# EAGLE design tabletmini (EAGLE 8.4.3)
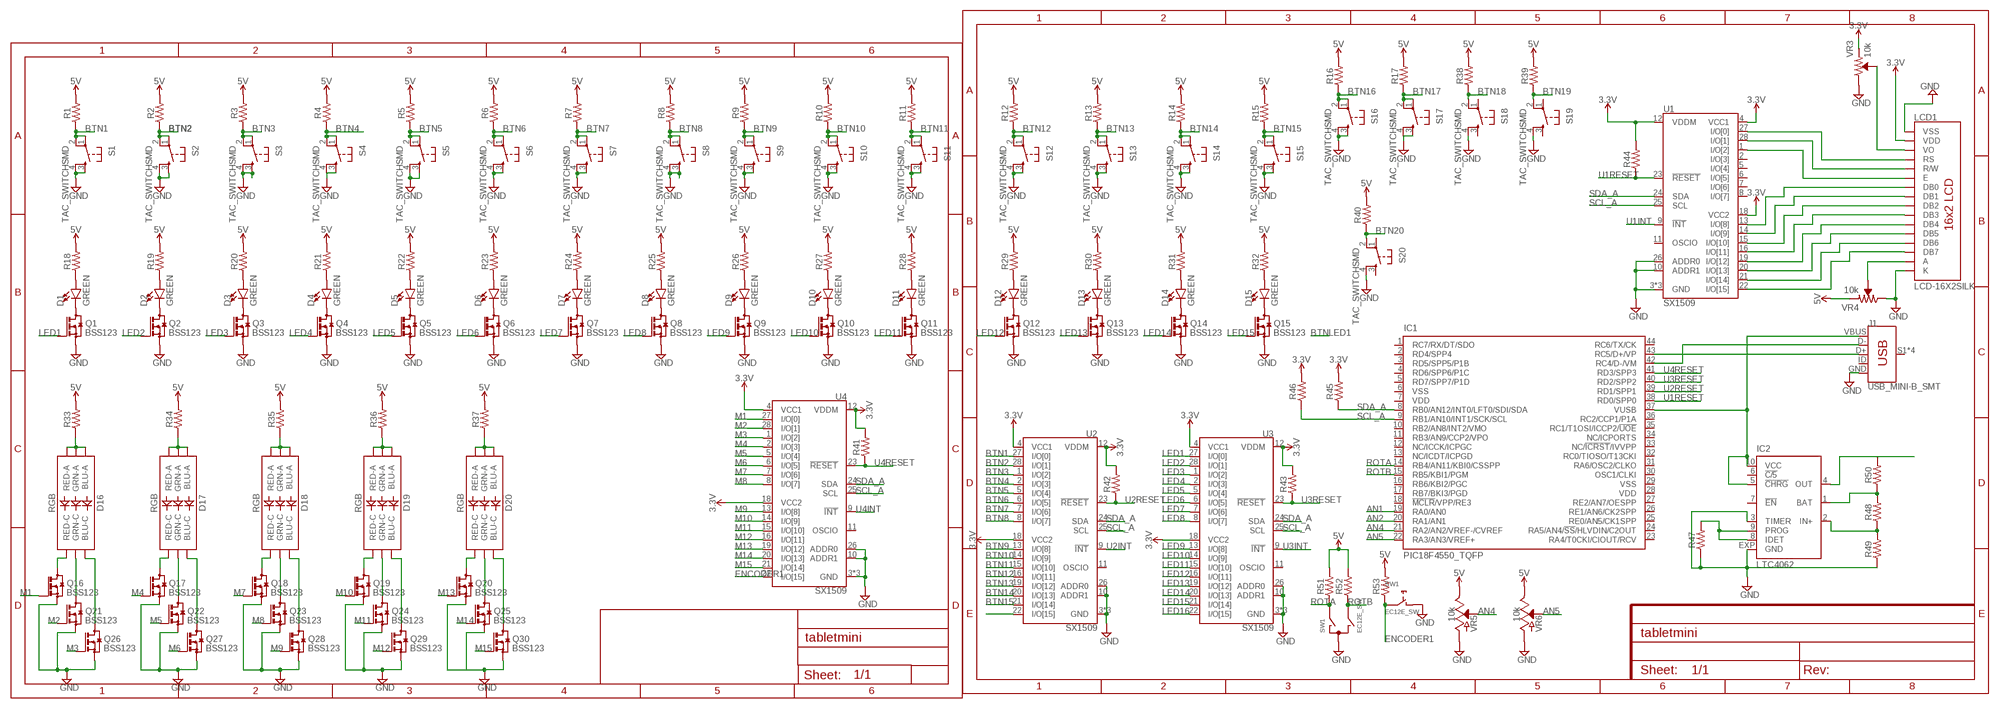
[diagram p0: schematic, sheet 1]

## Parts
D1  GREEN  LED-GREEN1206  [LED-1206]
D2  GREEN  LED-GREEN1206  [LED-1206]
D3  GREEN  LED-GREEN1206  [LED-1206]
D4  GREEN  LED-GREEN1206  [LED-1206]
D5  GREEN  LED-GREEN1206  [LED-1206]
D6  GREEN  LED-GREEN1206  [LED-1206]
D7  GREEN  LED-GREEN1206  [LED-1206]
D8  GREEN  LED-GREEN1206  [LED-1206]
D9  GREEN  LED-GREEN1206  [LED-1206]
D10  GREEN  LED-GREEN1206  [LED-1206]
D11  GREEN  LED-GREEN1206  [LED-1206]
D12  GREEN  LED-GREEN1206  [LED-1206]
D13  GREEN  LED-GREEN1206  [LED-1206]
D14  GREEN  LED-GREEN1206  [LED-1206]
D15  GREEN  LED-GREEN1206  [LED-1206]
D16  RGB  LED-RGBPLCC-6  [PLCC-6-LED]
D17  RGB  LED-RGBPLCC-6  [PLCC-6-LED]
D18  RGB  LED-RGBPLCC-6  [PLCC-6-LED]
D19  RGB  LED-RGBPLCC-6  [PLCC-6-LED]
D20  RGB  LED-RGBPLCC-6  [PLCC-6-LED]
IC1  PIC18F4550_TQFP  [TQFP44]
IC2  LTC4062  [DFN10-3X3]
J1  USB_MINI-B_SMT  [USB-MINIB]
LCD1  LCD-16X2SILK  [LCD-16X2]
Q1  BSS123  [SOT23]
Q2  BSS123  [SOT23]
Q3  BSS123  [SOT23]
Q4  BSS123  [SOT23]
Q5  BSS123  [SOT23]
Q6  BSS123  [SOT23]
Q7  BSS123  [SOT23]
Q8  BSS123  [SOT23]
Q9  BSS123  [SOT23]
Q10  BSS123  [SOT23]
Q11  BSS123  [SOT23]
Q12  BSS123  [SOT23]
Q13  BSS123  [SOT23]
Q14  BSS123  [SOT23]
Q15  BSS123  [SOT23]
Q16  BSS123  [SOT23]
Q17  BSS123  [SOT23]
Q18  BSS123  [SOT23]
Q19  BSS123  [SOT23]
Q20  BSS123  [SOT23]
Q21  BSS123  [SOT23]
Q22  BSS123  [SOT23]
Q23  BSS123  [SOT23]
Q24  BSS123  [SOT23]
Q25  BSS123  [SOT23]
Q26  BSS123  [SOT23]
Q27  BSS123  [SOT23]
Q28  BSS123  [SOT23]
Q29  BSS123  [SOT23]
Q30  BSS123  [SOT23]
R1  RESISTOR1206  [1206]
R2  RESISTOR1206  [1206]
R3  RESISTOR1206  [1206]
R4  RESISTOR1206  [1206]
R5  RESISTOR1206  [1206]
R6  RESISTOR1206  [1206]
R7  RESISTOR1206  [1206]
R8  RESISTOR1206  [1206]
R9  RESISTOR1206  [1206]
R10  RESISTOR1206  [1206]
R11  RESISTOR1206  [1206]
R12  RESISTOR1206  [1206]
R13  RESISTOR1206  [1206]
R14  RESISTOR1206  [1206]
R15  RESISTOR1206  [1206]
R16  RESISTOR1206  [1206]
R17  RESISTOR1206  [1206]
R18  RESISTOR1206  [1206]
R19  RESISTOR1206  [1206]
R20  RESISTOR1206  [1206]
R21  RESISTOR1206  [1206]
R22  RESISTOR1206  [1206]
R23  RESISTOR1206  [1206]
R24  RESISTOR1206  [1206]
R25  RESISTOR1206  [1206]
R26  RESISTOR1206  [1206]
R27  RESISTOR1206  [1206]
R28  RESISTOR1206  [1206]
R29  RESISTOR1206  [1206]
R30  RESISTOR1206  [1206]
R31  RESISTOR1206  [1206]
R32  RESISTOR1206  [1206]
R33  RESISTOR1206  [1206]
R34  RESISTOR1206  [1206]
R35  RESISTOR1206  [1206]
R36  RESISTOR1206  [1206]
R37  RESISTOR1206  [1206]
R38  RESISTOR1206  [1206]
R39  RESISTOR1206  [1206]
R40  RESISTOR1206  [1206]
R41  RESISTOR1206  [1206]
R42  RESISTOR1206  [1206]
R43  RESISTOR1206  [1206]
R44  RESISTOR1206  [1206]
R45  RESISTOR1206  [1206]
R46  RESISTOR1206  [1206]
R47  RESISTOR1206  [1206]
R48  RESISTOR1206  [1206]
R49  RESISTOR1206  [1206]
R50  RESISTOR1206  [1206]
R51  RESISTOR1206  [1206]
R52  RESISTOR1206  [1206]
R53  RESISTOR1206  [1206]
S1  TAC_SWITCHSMD  [TACTILE-SWITCH-SMD]
S2  TAC_SWITCHSMD  [TACTILE-SWITCH-SMD]
S3  TAC_SWITCHSMD  [TACTILE-SWITCH-SMD]
S4  TAC_SWITCHSMD  [TACTILE-SWITCH-SMD]
S5  TAC_SWITCHSMD  [TACTILE-SWITCH-SMD]
S6  TAC_SWITCHSMD  [TACTILE-SWITCH-SMD]
S7  TAC_SWITCHSMD  [TACTILE-SWITCH-SMD]
S8  TAC_SWITCHSMD  [TACTILE-SWITCH-SMD]
S9  TAC_SWITCHSMD  [TACTILE-SWITCH-SMD]
S10  TAC_SWITCHSMD  [TACTILE-SWITCH-SMD]
S11  TAC_SWITCHSMD  [TACTILE-SWITCH-SMD]
S12  TAC_SWITCHSMD  [TACTILE-SWITCH-SMD]
S13  TAC_SWITCHSMD  [TACTILE-SWITCH-SMD]
S14  TAC_SWITCHSMD  [TACTILE-SWITCH-SMD]
S15  TAC_SWITCHSMD  [TACTILE-SWITCH-SMD]
S16  TAC_SWITCHSMD  [TACTILE-SWITCH-SMD]
S17  TAC_SWITCHSMD  [TACTILE-SWITCH-SMD]
S18  TAC_SWITCHSMD  [TACTILE-SWITCH-SMD]
S19  TAC_SWITCHSMD  [TACTILE-SWITCH-SMD]
S20  TAC_SWITCHSMD  [TACTILE-SWITCH-SMD]
SW1  EC12E_SW  [ALPS_EC12E_SW]
U1  SX1509  [QFN-28]
U2  SX1509  [QFN-28]
U3  SX1509  [QFN-28]
U4  SX1509  [QFN-28]
VR3  10k  TRIMPOT-SMD-3MM-CLOSED-1/8W-20%  [TRIMPOT-SMD-3MM-CLOSED]
VR4  10k  TRIMPOT-SMD-3MM-CLOSED-1/8W-20%  [TRIMPOT-SMD-3MM-CLOSED]
VR5  10k  POTENTIOMETER-PTH-9MM-1/20W-20%-KIT  [POT-PTH-ALPS-KIT]
VR6  10k  POTENTIOMETER-PTH-9MM-1/20W-20%-KIT  [POT-PTH-ALPS-KIT]

## Nets
3.3V: LCD1.2(VDD) R41.2 R42.2 R43.2 R44.2 R45.2 R46.2 U1.4(VCC1) U1.12(VDDM) U1.18(VCC2) U2.4(VCC1) U2.12(VDDM) U2.18(VCC2) U3.4(VCC1) U3.12(VDDM) U3.18(VCC2) U4.4(VCC1) U4.12(VDDM) U4.18(VCC2) VR3.1(CCW)
5V: R1.2 R2.2 R3.2 R4.2 R5.2 R6.2 R7.2 R8.2 R9.2 R10.2 R11.2 R12.2 R13.2 R14.2 R15.2 R16.2 R17.2 R18.2 R19.2 R20.2 R21.2 R22.2 R23.2 R24.2 R25.2 R26.2 R27.2 R28.2 R29.2 R30.2 R31.2 R32.2 R33.2 R34.2 R35.2 R36.2 R37.2 R38.2 R39.2 R40.2 R51.2 R52.2 R53.2 VR4.1(CCW) VR5.P$1(E) VR6.P$1(E)
AN1: IC1.19(RA0/AN0)
AN2: IC1.20(RA1/AN1)
AN4: IC1.21(RA2/AN2/VREF-/CVREF) VR5.P$2(S)
AN5: IC1.22(RA3/AN3/VREF+) VR6.P$2(S)
BTN1: R1.1 S1.1 S1.2 U2.27(I/O[0])
BTN2: R2.1 S2.1 S2.2 U2.28(I/O[1])
BTN3: R3.1 S3.1 S3.2 U2.1(I/O[2])
BTN4: R4.1 S4.1 S4.2 U2.2(I/O[3])
BTN5: R5.1 S5.1 S5.2 U2.5(I/O[4])
BTN6: R6.1 S6.1 S6.2 U2.6(I/O[5])
BTN7: R7.1 S7.1 S7.2 U2.7(I/O[6])
BTN8: R8.1 S8.1 S8.2 U2.8(I/O[7])
BTN9: R9.1 S9.1 S9.2 U2.13(I/O[8])
BTN10: R10.1 S10.1 S10.2 U2.14(I/O[9])
BTN11: R11.1 S11.1 S11.2 U2.15(I/O[10])
BTN12: R12.1 S12.1 S12.2 U2.16(I/O[11])
BTN13: R13.1 S13.1 S13.2 U2.19(I/O[12])
BTN14: R14.1 S14.1 S14.2 U2.20(I/O[13])
BTN15: R15.1 S15.1 S15.2 U2.21(I/O[14])
BTN16: R16.1 S16.1 S16.2
BTN17: R17.1 S17.1 S17.2
BTN18: R38.1 S18.2
BTN19: R39.1 S19.2
BTN20: R40.1 S20.2
ENCODER1: R53.1 SW1.E U4.22(I/O[15])
GND: IC2.3(TIMER) IC2.EXP(GND) J1.GND LCD1.1(VSS) LCD1.16(K) Q1.2(S) Q2.2(S) Q3.2(S) Q4.2(S) Q5.2(S) Q6.2(S) Q7.2(S) Q8.2(S) Q9.2(S) Q10.2(S) Q11.2(S) Q12.2(S) Q13.2(S) Q14.2(S) Q15.2(S) Q16.2(S) Q17.2(S) Q18.2(S) Q19.2(S) Q20.2(S) Q21.2(S) Q22.2(S) Q23.2(S) Q24.2(S) Q25.2(S) Q26.2(S) Q27.2(S) Q28.2(S) Q29.2(S) Q30.2(S) R47.1 R49.1 S1.3 S1.4 S2.3 S2.4 S3.3 S3.4 S4.3 S4.4 S5.3 S5.4 S6.3 S6.4 S7.3 S7.4 S8.3 S8.4 S9.3 S9.4 S10.3 S10.4 S11.3 S11.4 S12.3 S12.4 S13.3 S13.4 S14.3 S14.4 S15.3 S15.4 S16.3 S16.4 S17.3 S17.4 S18.4 S19.4 S20.4 SW1.C SW1.D U1.3(GND) U1.10(ADDR1) U1.17(GND) U1.26(ADDR0) U1.29(GND) U2.3(GND) U2.10(ADDR1) U2.17(GND) U2.26(ADDR0) U2.29(GND) U3.3(GND) U3.10(ADDR1) U3.17(GND) U3.26(ADDR0) U3.29(GND) U4.3(GND) U4.10(ADDR1) U4.17(GND) U4.26(ADDR0) U4.29(GND) VR3.3(CW) VR4.3(CW) VR5.P$3(A) VR6.P$3(A)
LED1: Q1.1(G) U3.27(I/O[0])
LED2: Q2.1(G) U3.28(I/O[1])
LED3: Q3.1(G) U3.1(I/O[2])
LED4: Q4.1(G) U3.2(I/O[3])
LED5: Q5.1(G) U3.5(I/O[4])
LED6: Q6.1(G) U3.6(I/O[5])
LED7: Q7.1(G) U3.7(I/O[6])
LED8: Q8.1(G) U3.8(I/O[7])
LED9: Q9.1(G) U3.13(I/O[8])
LED10: Q10.1(G) U3.14(I/O[9])
LED11: Q11.1(G) U3.15(I/O[10])
LED12: Q12.1(G) U3.16(I/O[11])
LED13: Q13.1(G) U3.19(I/O[12])
LED14: Q14.1(G) U3.20(I/O[13])
LED15: Q15.1(G) U3.21(I/O[14])
LED16: U3.22(I/O[15])
M1: Q16.1(G) U4.27(I/O[0])
M2: Q21.1(G) U4.28(I/O[1])
M3: Q26.1(G) U4.1(I/O[2])
M4: Q17.1(G) U4.2(I/O[3])
M5: Q22.1(G) U4.5(I/O[4])
M6: Q27.1(G) U4.6(I/O[5])
M7: Q18.1(G) U4.7(I/O[6])
M8: Q23.1(G) U4.8(I/O[7])
M9: Q28.1(G) U4.13(I/O[8])
M10: Q19.1(G) U4.14(I/O[9])
M11: Q24.1(G) U4.15(I/O[10])
M12: Q29.1(G) U4.16(I/O[11])
M13: Q20.1(G) U4.19(I/O[12])
M14: Q25.1(G) U4.20(I/O[13])
M15: Q30.1(G) U4.21(I/O[14])
N$1: IC1.37(VUSB) IC2.5(!CHRG) IC2.10(VCC) J1.VBUS
N$2: IC1.42(RC4/D-/VM) J1.D-
N$3: IC1.43(RC5/D+/VP) J1.D+
N$4: LCD1.4(RS) U1.27(I/O[0])
N$5: LCD1.5(R/W) U1.28(I/O[1])
N$6: LCD1.6(E) U1.1(I/O[2])
N$7: LCD1.7(DB0) U1.13(I/O[8])
N$8: LCD1.8(DB1) U1.14(I/O[9])
N$9: LCD1.9(DB2) U1.15(I/O[10])
N$10: LCD1.10(DB3) U1.16(I/O[11])
N$11: LCD1.11(DB4) U1.19(I/O[12])
N$12: LCD1.12(DB5) U1.20(I/O[13])
N$13: LCD1.13(DB6) U1.21(I/O[14])
N$14: LCD1.14(DB7) U1.22(I/O[15])
N$15: U2.22(I/O[15])
N$17: IC2.2(IN+) R48.1 R49.2
N$18: LCD1.15(A) VR4.2(WIPER)
N$19: LCD1.3(VO) VR3.2(WIPER)
N$20: IC2.1(BAT) R48.2 R50.1
N$22: IC2.4(OUT)
N$24: IC2.8(IDET) IC2.9(PROG) R47.2
N$37: D1.C Q1.3(D)
N$38: D1.A R18.1
N$39: D2.C Q2.3(D)
N$40: D2.A R19.1
N$41: D3.C Q3.3(D)
N$42: D3.A R20.1
N$43: D4.C Q4.3(D)
N$44: D4.A R21.1
N$45: D5.C Q5.3(D)
N$46: D5.A R22.1
N$47: D6.C Q6.3(D)
N$48: D6.A R23.1
N$49: D7.C Q7.3(D)
N$50: D7.A R24.1
N$51: D8.C Q8.3(D)
N$52: D8.A R25.1
N$53: D9.C Q9.3(D)
N$54: D9.A R26.1
N$55: D10.C Q10.3(D)
N$56: D10.A R27.1
N$57: D11.C Q11.3(D)
N$58: D11.A R28.1
N$59: D12.C Q12.3(D)
N$60: D12.A R29.1
N$61: D13.C Q13.3(D)
N$62: D13.A R30.1
N$63: D14.C Q14.3(D)
N$64: D14.A R31.1
N$65: D15.C Q15.3(D)
N$66: D15.A R32.1
N$67: D16.AB(BLU-A) D16.AR(RED-A) R33.1
N$68: D17.AB(BLU-A) D17.AR(RED-A) R34.1
N$69: D18.AB(BLU-A) D18.AR(RED-A) R35.1
N$70: D19.AB(BLU-A) D19.AR(RED-A) R36.1
N$71: D20.AB(BLU-A) D20.AR(RED-A) R37.1
N$72: D16.CR(RED-C) Q16.3(D)
N$73: D16.CG(GRN-C) Q21.3(D)
N$74: D16.CB(BLU-C) Q26.3(D)
N$78: D17.CR(RED-C) Q17.3(D)
N$79: D17.CG(GRN-C) Q22.3(D)
N$80: D17.CB(BLU-C) Q27.3(D)
N$84: D18.CR(RED-C) Q18.3(D)
N$85: D18.CG(GRN-C) Q23.3(D)
N$86: D18.CB(BLU-C) Q28.3(D)
N$90: D19.CR(RED-C) Q19.3(D)
N$91: D19.CG(GRN-C) Q24.3(D)
N$92: D19.CB(BLU-C) Q29.3(D)
N$96: D20.CR(RED-C) Q20.3(D)
N$97: D20.CG(GRN-C) Q25.3(D)
N$98: D20.CB(BLU-C) Q30.3(D)
ROTA: IC1.14(RB4/AN11/KBI0/CSSPP) R51.1 SW1.A
ROTB: IC1.15(RB5/KBI1/PGM) R52.1 SW1.B
SCL_A: IC1.9(RB1/AN10/INT1/SCK/SCL) R46.1 U1.25(SCL) U2.25(SCL) U3.25(SCL) U4.25(SCL)
SDA_A: IC1.8(RB0/AN12/INT0/LFT0/SDI/SDA) R45.1 U1.24(SDA) U2.24(SDA) U3.24(SDA) U4.24(SDA)
U1INT: U1.9(!INT)
U1RESET: IC1.38(RD0/SPP0) R44.1 U1.23(!RESET)
U2INT: U2.9(!INT)
U2RESET: IC1.39(RD1/SPP1) R42.1 U2.23(!RESET)
U3INT: U3.9(!INT)
U3RESET: IC1.40(RD2/SPP2) R43.1 U3.23(!RESET)
U4INT: U4.9(!INT)
U4RESET: IC1.41(RD3/SPP3) R41.1 U4.23(!RESET)
Unconnected: D16.AG(GRN-A) D17.AG(GRN-A) D18.AG(GRN-A) D19.AG(GRN-A) D20.AG(GRN-A) IC1.1(RC7/RX/DT/SDO) IC1.2(RD4/SPP4) IC1.3(RD5/SPP5/P1B) IC1.4(RD6/SPP6/P1C) IC1.5(RD7/SPP7/P1D) IC1.10(RB2/AN8/INT2/VMO) IC1.11(RB3/AN9/CCP2/VPO) IC1.12(NC/ICCK/ICPGC) IC1.13(NC/ICDT/ICPGD) IC1.16(RB6/KBI2/PGC) IC1.17(RB7/BKI3/PGD) IC1.18(!MCLR!/VPP/RE3) IC1.23(RA4/T0CKI/CIOUT/RCV) IC1.24(RA5/AN4/!SS!/HLVDIN/C2OUT) IC1.25(RE0/AN5/CK1SPP) IC1.26(RE1/AN6/CK2SPP) IC1.27(RE2/AN7/OESPP) IC1.30(OSC1/CLKI) IC1.31(RA6/OSC2/CLKO) IC1.32(RC0/TIOSO/T13CKI) IC1.33(NC/!ICRST!/IVVPP) IC1.34(NC/ICPORTS) IC1.35(RC1/T1OSI/ICCP2/!UOE) IC1.36(RC2/CCP1/P1A) IC1.44(RC6/TX/CK) IC2.6(!C/5) IC2.7(!EN) J1.ID J1.S1(SHIELD) J1.S2(SHIELD) J1.S3(SHIELD) J1.S4(SHIELD) R50.2 S18.1 S18.3 S19.1 S19.3 S20.1 S20.3 SW1.GND1(G) SW1.GND2(G) U1.2(I/O[3]) U1.5(I/O[4]) U1.6(I/O[5]) U1.7(I/O[6]) U1.8(I/O[7]) U1.11(OSCIO) U2.11(OSCIO) U3.11(OSCIO) U4.11(OSCIO)

## Power pins joined to a net without a drawn wire
VDD: IC1.7(VDD) IC1.28(VDD)
VSS: IC1.6(VSS) IC1.29(VSS)

## Library data of the parts
D1-D15 = SparkFun-LED:LED-GREEN: Green SMD LED Used in manufacturing of various products at SparkFun Packages: 0603 - SMD 0603 package [Product Link] <http://www.futureelectronics.com/en/technologies/semiconductors/optoelectronics/leds/Pages/9894312-LTST-C190GKT.aspx?CrossPart=HSMG-C190&IM=0> LilyPad 1206 - SMD1206 LilyPad package [Product Link] <http://www.futureelectronics.com/en/Technologies/Product.aspx?ProductID=IN150NGHARVATEKCORPORATION2049943&IM=0> 1206 - SMD1206 package [Product Link] <http://www.futureelectronics.com/en/technologies/semiconductors/optoelectronics/leds/Pages/8315665-LTST-C150KGKT.aspx?IM=0> 1206 Bottom Mount -SMD 1206 Bottom Mount [Product Link] <http://www.digikey.com/product-detail/en/lite-on-inc/LTST-C230KGKT/160-1456-1-ND/386854> SparkFun Products: Pro Mini 328 -5V <https://www.sparkfun.com/products/821> RedBoard <https://www.sparkfun.com/products/12757> MP3 Trigger <https://www.sparkfun.com/products/13720> Makey Makey <https://www.sparkfun.com/products/11076>; PROD_ID: DIO-00862
D16-D20 = SparkFun-LED:LED-RGB: LED-RGB 6 pin RGB LED (no common connector) Packages: PLCC-6 LED-TRICOLOR-5050 - No built-in IC SparkFun Products: Digital Sandbox <https://www.sparkfun.com/products/12651> LED- SMD RGB <https://www.sparkfun.com/products/10866>; PROD_ID: DIO-12113
IC1 = microchip:PIC18F4*_TQFP: USB Microcontrollers with nanoWatt Technology High-Performance, Enhanced Flash, 28/40/44-Pin, Source: http://ww1.microchip.com/downloads/en/devicedoc/39632c.pdf; MF: MICROCHIP; MPN: PIC18F4550-I/PT; OC_FARNELL: 9321365; OC_NEWARK: 08J9633
IC2 = linear-technology:LTC4062: Standalone Linear Li-Ion Battery Charger with Micropower Comparator Source: http://www.linear.com .. 4062fa.pdf; MPN: LTC4062EDD#PBF; OC_FARNELL: 1648037; OC_NEWARK: 58M0900
J1 = SparkFun-Connectors:USB_MINI-B: USB type Mini-B Connector Breaks out 5th pin, and includes shield pins if needed. SparkFun Products: SparkFun FTDI Basic Breakout <https://www.sparkfun.com/products/9716> SparkFun XBee Explorer USB <https://www.sparkfun.com/products/11812> SparkFun Redboard <https://www.sparkfun.com/products/12757>; PROD_ID: CONN-08193; SF_ID: PRT-00587
LCD1 = SparkFun-Displays:LCD-16X2: Standard text-only 16x2 parallel input LCD Basic 16 character by 2 line display. Typically utilizes the extremely common HD44780 parallel interface chipset SparkFun Products: Basic 16x2 Green <https://www.sparkfun.com/products/255> Basic 8x2 Green <https://www.sparkfun.com/products/11122>; SF_ID: LCD-00255
Q1-Q30 = transistor-small-signal:BSS123: N-CHANNEL MOS FET
R1-R53 = SparkFun-Resistors:RESISTOR: Generic Resistor Package
S1-S20 = SparkFun-Retired:TAC_SWITCH: Momentary Switch Button commonly used for reset or general input. Spark Fun Electronics SKU : COM-00097 SMT- SWCH-08247; PROD_ID: SWCH-08247
SW1 = switch-alps:EC12E_SW: ALPS rotary Encoder EC12E series with switch; MPN: EC12E2424407; OC_FARNELL: 1520813; OC_NEWARK: 74M1068
U1-U4 = SparkFun-IC-Special-Function:SX1509: Semtech SX1509 The SX1509 is a complete ultra low voltage 1.2V to 3.6V General Purpose parallel Input/Output (GPIO) expanders ideal for low power handheld battery powered equipment. This version comes in a 16-channel configuration and allows easy serial expansion of I/O through a standard 400kHz I2C interface. GPIO devices can provide additional control and monitoring when the microcontroller or chipset has insufficient I/O ports, or in systems where serial communication and control from a remote location is advantageous. Datasheet <http://cdn.sparkfun.com/datasheets/BreakoutBoards/sx1509.pdf> SparkFun Products SparkFun 16 Output I/O Expander Breakout - SX1509 <https://www.sparkfun.com/products/13601> (BOB-13601) SparkFun Line Follower Array <https://www.sparkfun.com/products/13582> (SEN-13582); PROD_ID: IC-11311
VR3 VR4 = SparkFun-Resistors:TRIMPOT: Trimming Potentiometer (Trimpot) Three-terminal potentiometers, with an adjustable wiper and two adjustable resistors. A pot can be used to create a configurable voltage divider, or as a variable resistor. "Trimpots" are a subset of potentiometers, usually intended for "set-and-forget" applications. They're often more delicate than standard potentiometers - rated for fewer turns. Variants PTH-KNOB - PTH Trimpot w/ finger-adjustable knob Trimpot 10K with Knob <https://www.sparkfun.com/products/9806> (COM-09806) Datasheet <http://www.sparkfun.com/datasheets/Components/General/TSR-3386.pdf> SMD-3MM-CLOSED-FRAME - SMD 3mm Square Closed-Frame Trimpot Used on e.g. EasyDriver - Stepper Motor Driver <https://www.sparkfun.com/products/12779> Datasheet <http://www.bitechnologies.com/pdfs/22.pdf> (22AR10KTR) SMD-5MM - SMD 5mm Square Closed-Frame Trimpot Used on e.g. IOIO-OTG - V2.2 <https://www.sparkfun.com/products/13613> Datasheet <http://www.vishay.com/docs/51008/ts53.pdf> (TS53YL502MR10) SMD-3MM-1/10W-25% - 3mm Square Open-Frame Trimpot Used on e.g. SparkFun Shapeoko <https://www.sparkfun.com/products/13899> Datasheet <http://www.bourns.com/docs/Product-Datasheets/TC33.pdf> (TC33X-2-103E); PROD_ID: RES-09285
VR5 VR6 = SparkFun-Resistors:POTENTIOMETER: Potentiometer (Pot) Three-terminal potentiometers, with an adjustable wiper and two adjustable resistors. A pot can be used to create a configurable voltage divider, or as a variable resistor. Variants ALPS_POT and ALPS_POT_KIT - PTH, breadboard compatible, 9mm square pots Rotary Potentiometer - Linear (10k ohm) <https://www.sparkfun.com/products/9288> (COM-09288) The KIT variant exposes copper on only one side of the PTH pad, so the part can only be assembled on one side of the PCB. Useful for beginner soldering kits.; PROD_ID: RES-09177; SF_SKU: COM-09288

## Board
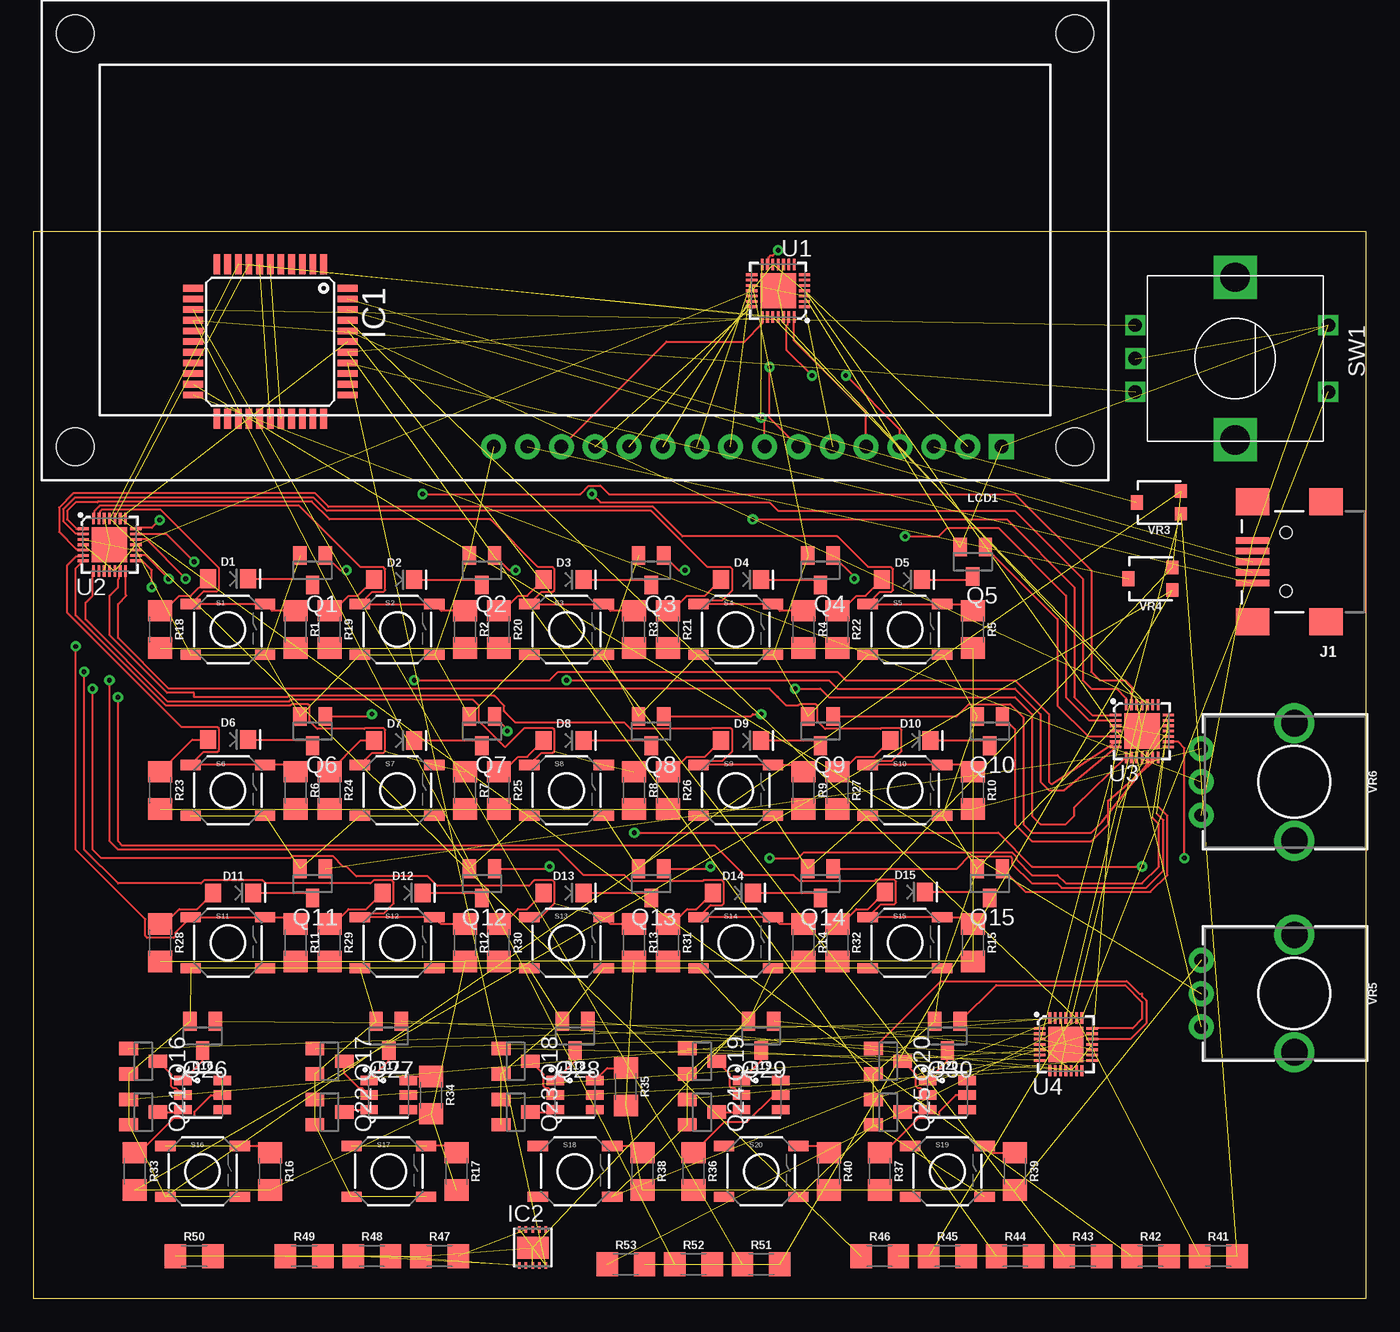
[diagram p1: board, top side]
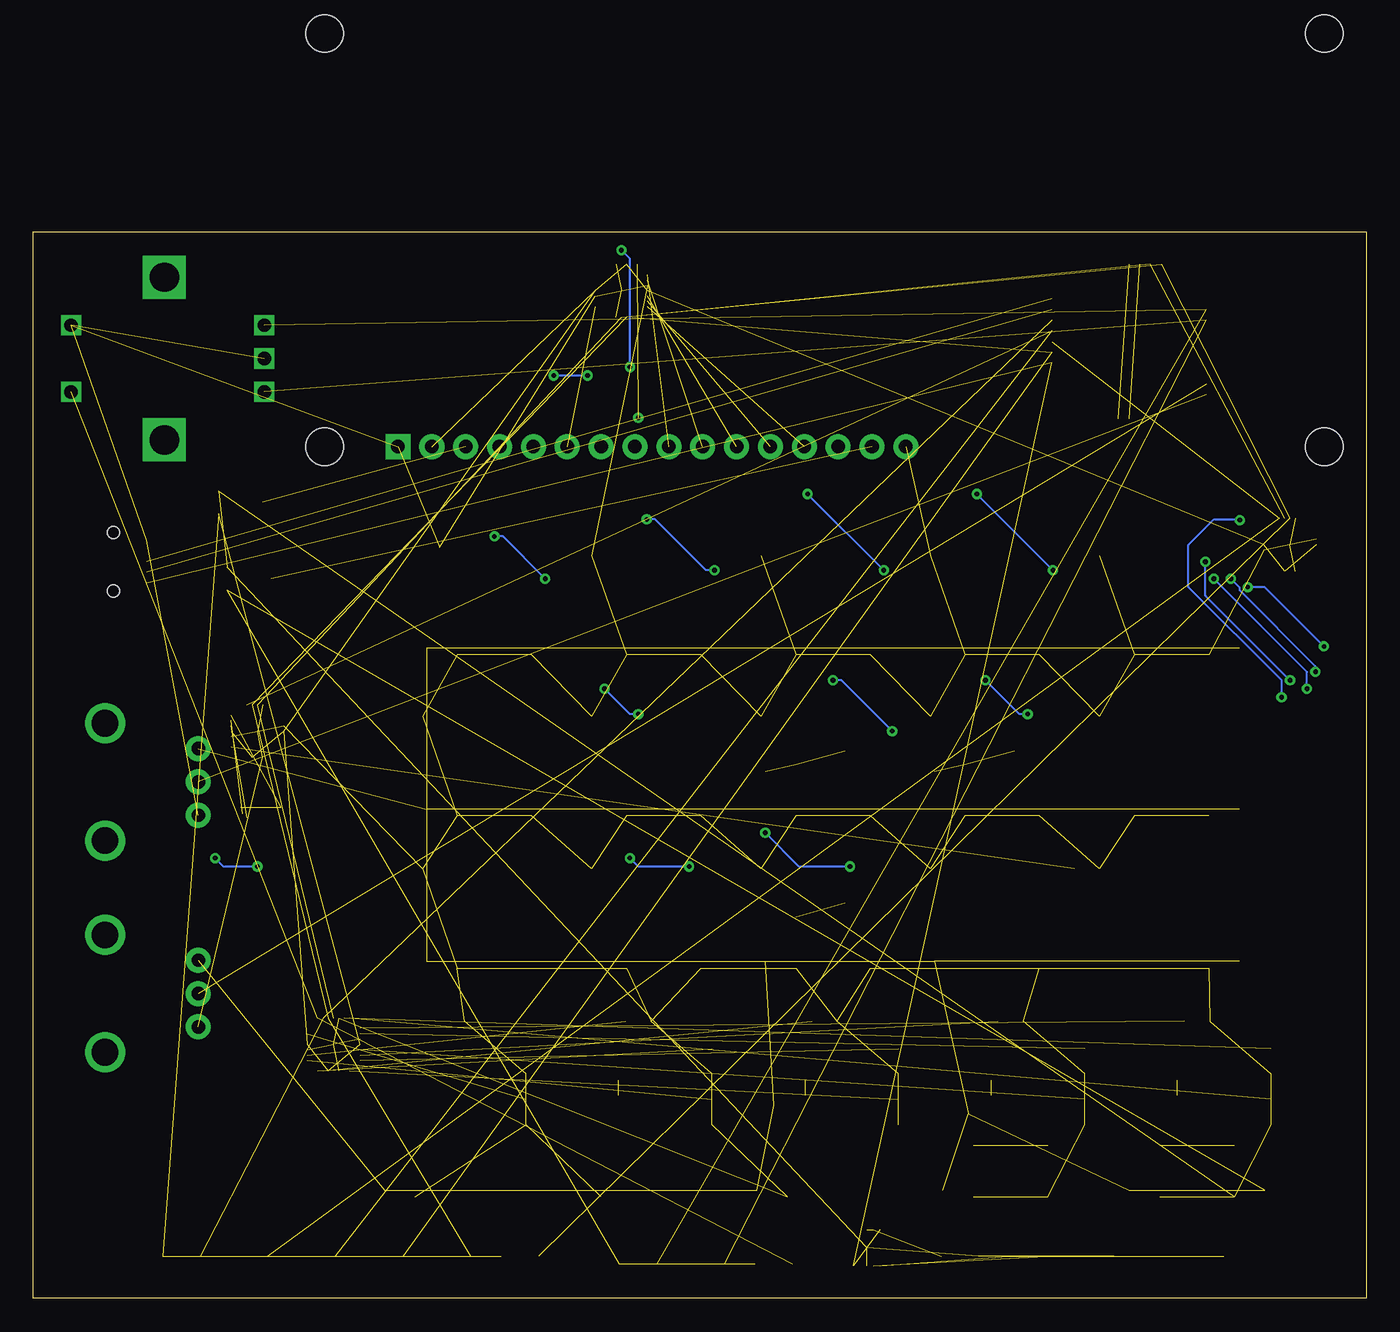
[diagram p2: board, bottom side, seen from below]

Size 100 x 80 mm. Coordinates in mm from the lower left corner, seen from the top.
Outline: 0,0 100,0 100,80 0,80 0,0
Copper layers (1*16): Top 0.035mm / dielectric 1.5mm / Bottom 0.035mm
Design rules "default": minimum track width 6mil, minimum drill 0.35mm, track to track 6mil, track to pad 6mil, pad to pad 6mil, via to via 6mil, smd to smd 6mil, copper to edge 40mil, drill to drill 6mil, minimum pad ring 10mil, minimum via ring 8mil, stop-mask expansion 4mil, vias tented up to drill 0mil, thermal gap 10mil

### Footprints (pad centres in the part's own frame; a part is rotated, then mirrored left to right if it is on the bottom)
LED-1206 = smd 1.2 x 1.4: A -1.5,0; C 1.5,0
PLCC-6-LED = smd 1.3 x 0.7: AB 1.475,1.1; AG 1.475,-1.1; AR 1.475,0; CB -1.475,1.1; CG -1.475,-1.1; CR -1.475,0
TQFP44 = smd 1.5 x 0.5: 1 -5.8,4; 2 -5.8,3.2; 3 -5.8,2.4; 4 -5.8,1.6; 5 -5.8,0.8; 6 -5.8,0; 7 -5.8,-0.8; 8 -5.8,-1.6; 9 -5.8,-2.4; 10 -5.8,-3.2; 11 -5.8,-4; 23 5.8,-4; 24 5.8,-3.2; 25 5.8,-2.4; 26 5.8,-1.6; 27 5.8,-0.8; 28 5.8,0; 29 5.8,0.8; 30 5.8,1.6; 31 5.8,2.4; 32 5.8,3.2; 33 5.8,4 | smd 0.5 x 1.5: 12 -4,-5.8; 13 -3.2,-5.8; 14 -2.4,-5.8; 15 -1.6,-5.8; 16 -0.8,-5.8; 17 0,-5.8; 18 0.8,-5.8; 19 1.6,-5.8; 20 2.4,-5.8; 21 3.2,-5.8; 22 4,-5.8; 34 4,5.8; 35 3.2,5.8; 36 2.4,5.8; 37 1.6,5.8; 38 0.8,5.8; 39 0,5.8; 40 -0.8,5.8; 41 -1.6,5.8; 42 -2.4,5.8; 43 -3.2,5.8; 44 -4,5.8
DFN10-3X3 = smd 0.25 x 0.45: 1 -1,-1.35; 2 -0.5,-1.35; 3 0,-1.35; 4 0.5,-1.35; 5 1,-1.35; 6 1,1.35; 7 0.5,1.35; 8 0,1.35; 9 -0.5,1.35; 10 -1,1.35 | smd 2.38 x 1.65: EXP 0,0
USB-MINIB = smd 2.5 x 0.5: D+ 2.5,0; D- 2.5,0.8; GND 2.5,-1.6; ID 2.5,-0.8; VBUS 2.5,1.6 | smd 2.5 x 2: S1 -3,4.5; S2 2.5,4.5; S3 -3,-4.5; S4 2.5,-4.5 | hole 0.9: 0,2.2; 0,-2.2
LCD-16X2 = drill 1.016 pad 1.88 square: 1 -32,15.5 | drill 1.016 pad 1.88: 2 -29.46,15.5; 3 -26.92,15.5; 4 -24.38,15.5; 5 -21.84,15.5; 6 -19.3,15.5; 7 -16.76,15.5; 8 -14.22,15.5; 9 -11.68,15.5; 10 -9.14,15.5; 11 -6.6,15.5; 12 -4.06,15.5; 13 -1.52,15.5; 14 1.02,15.5; 15 3.56,15.5; 16 6.1,15.5 | hole 2.8: -37.5,15.5; -37.5,-15.5; 37.5,15.5; 37.5,-15.5
SOT23 = smd 1 x 1.4: 1 -0.95,-1.1; 2 0.95,-1.1; 3 0,1.1
1206 = smd 1.6 x 1.8: 1 -1.4,0; 2 1.4,0
TACTILE-SWITCH-SMD = smd 1.524 x 0.762: 1 -2.794,1.905; 2 2.794,1.905; 3 -2.794,-1.905; 4 2.794,-1.905
ALPS_EC12E_SW = drill 1 square: A -2.5,-7.5; B 2.5,-7.5; C 0,-7.5; D -2.5,7; E 2.5,7 | drill 2.2 square: GND1 -6.1,0; GND2 6.1,0
QFN-28 = smd 0.85 x 0.2: 1 -1.975,1.2; 2 -1.975,0.8; 3 -1.975,0.4; 4 -1.975,0; 5 -1.975,-0.4; 6 -1.975,-0.8; 7 -1.975,-1.2; 15 1.975,-1.2; 16 1.975,-0.8; 17 1.975,-0.4; 18 1.975,0; 19 1.975,0.4; 20 1.975,0.8; 21 1.975,1.2 | smd 0.2 x 0.85: 8 -1.2,-1.975; 9 -0.8,-1.975; 10 -0.4,-1.975; 11 0,-1.975; 12 0.4,-1.975; 13 0.8,-1.975; 14 1.2,-1.975; 22 1.2,1.975; 23 0.8,1.975; 24 0.4,1.975; 25 0,1.975; 26 -0.4,1.975; 27 -0.8,1.975; 28 -1.2,1.975 | smd 2.65 x 2.65: 29 0,0
TRIMPOT-SMD-3MM-CLOSED = smd 1 x 0.9: 1 -0.85,-1.65; 3 0.85,-1.65 | smd 1.1 x 0.9: 2 0,1.65
POT-PTH-ALPS-KIT = drill 1 pad 1.88: P$1 7,-2.5; P$2 7,0; P$3 7,2.5 | drill 2: P$4 0,-4.4; P$5 0,4.4

### Placement (x,y rotation side)
D1  14.61,53.98 0 top
D2  27.07,53.91 0 top
D3  39.77,53.91 0 top
D4  53.11,53.91 0 top
D5  65.17,53.91 0 top
D6  14.61,41.91 0 top
D7  27.07,41.84 0 top
D8  39.77,41.84 0 top
D9  53.11,41.84 0 top
D10  65.81,41.84 0 top
D11  15.01,30.41 0 top
D12  27.71,30.41 0 top
D13  39.77,30.41 0 top
D14  52.48,30.41 0 top
D15  65.41,30.48 0 top
D16  12.7,15.24 0 top
D17  26.67,15.24 0 top
D18  40.64,15.24 0 top
D19  54.61,15.24 0 top
D20  68.58,15.24 0 top
IC1  17.78,71.75 270 top
IC2  37.47,3.81 0 top
J1  93.98,55.24 180 top
LCD1  40.64,79.38 180 top
Q1  20.95,54.61 180 top
Q2  33.66,54.61 180 top
Q3  46.35,54.61 180 top
Q4  59.05,54.61 180 top
Q5  70.48,55.24 180 top
Q6  20.95,42.55 180 top
Q7  33.66,42.55 180 top
Q8  46.35,42.55 180 top
Q9  59.05,42.55 180 top
Q10  71.75,42.55 180 top
Q11  20.95,31.11 180 top
Q12  33.66,31.11 180 top
Q13  46.35,31.11 180 top
Q14  59.05,31.11 180 top
Q15  71.75,31.11 180 top
Q16  8.26,17.78 270 top
Q17  22.23,17.78 270 top
Q18  36.2,17.78 270 top
Q19  50.16,17.78 270 top
Q20  64.14,17.78 270 top
Q21  8.26,13.97 270 top
Q22  22.23,13.97 270 top
Q23  36.2,13.97 270 top
Q24  50.16,13.97 270 top
Q25  64.14,13.97 270 top
Q26  12.7,19.68 180 top
Q27  26.67,19.68 180 top
Q28  40.64,19.68 180 top
Q29  54.61,19.68 180 top
Q30  68.58,19.68 180 top
R1  19.68,50.16 270 top
R2  32.38,50.16 270 top
R3  45.09,50.16 270 top
R4  57.78,50.16 270 top
R5  70.48,50.16 270 top
R6  19.68,38.1 270 top
R7  32.38,38.1 270 top
R8  45.09,38.1 270 top
R9  57.78,38.1 270 top
R10  70.48,38.1 270 top
R11  19.68,26.67 270 top
R12  32.38,26.67 270 top
R13  45.09,26.67 270 top
R14  57.78,26.67 270 top
R15  70.48,26.67 270 top
R16  17.78,9.53 270 top
R17  31.75,9.53 270 top
R18  9.53,50.16 270 top
R19  22.23,50.16 270 top
R20  34.92,50.16 270 top
R21  47.62,50.16 270 top
R22  60.33,50.16 270 top
R23  9.53,38.1 270 top
R24  22.23,38.1 270 top
R25  34.92,38.1 270 top
R26  47.62,38.1 270 top
R27  60.33,38.1 270 top
R28  9.53,26.67 270 top
R29  22.23,26.67 270 top
R30  34.92,26.67 270 top
R31  47.62,26.67 270 top
R32  60.33,26.67 270 top
R33  7.62,9.53 270 top
R34  29.84,15.24 270 top
R35  44.45,15.88 270 top
R36  49.53,9.53 270 top
R37  63.5,9.53 270 top
R38  45.72,9.53 270 top
R39  73.66,9.53 270 top
R40  59.69,9.53 270 top
R41  88.9,3.17 0 top
R42  83.82,3.17 0 top
R43  78.74,3.17 0 top
R44  73.66,3.17 0 top
R45  68.58,3.17 0 top
R46  63.5,3.17 0 top
R47  30.48,3.17 0 top
R48  25.4,3.17 0 top
R49  20.32,3.17 0 top
R50  12.06,3.17 0 top
R51  54.61,2.54 0 top
R52  49.53,2.54 0 top
R53  44.45,2.54 0 top
S1  14.61,50.16 0 top
S2  27.3,50.16 0 top
S3  40.01,50.16 0 top
S4  52.7,50.16 0 top
S5  65.41,50.16 0 top
S6  14.61,38.1 0 top
S7  27.3,38.1 0 top
S8  40.01,38.1 0 top
S9  52.7,38.1 0 top
S10  65.41,38.1 0 top
S11  14.61,26.67 0 top
S12  27.3,26.67 0 top
S13  40.01,26.67 0 top
S14  52.7,26.67 0 top
S15  65.41,26.67 0 top
S16  12.7,9.53 0 top
S17  26.67,9.53 0 top
S18  40.64,9.53 0 top
S19  68.58,9.53 0 top
S20  54.61,9.53 0 top
SW1  90.17,70.48 270 top
U1  55.88,75.56 180 top
U2  5.71,56.52 0 top
U3  83.19,42.55 0 top
U4  77.47,19.05 0 top
VR3  84.45,59.69 90 top
VR4  83.82,53.98 90 top
VR5  94.61,22.86 180 top
VR6  94.61,38.73 180 top

### Tracks (layer width: path | path; a pad name or v marks a point on that pad's centre or on a via)
3.3V  (19 unrouted)
5V  (45 unrouted)
AN4  (1 unrouted)
AN5  (1 unrouted)
BTN1
  Top 0.152: R1.1 17.9,51.56 S1.2 S1.1 12.79,53.05 13.8,53.05 13.93,53.18 13.93,54.77 9.56,59.14 5.12,59.14 4.99,59.01 4.99,58.56 U2.27
BTN2
  Top 0.152: R2.1 30.6,51.56 S2.2 S2.1 25.42,52.98 26.27,52.98 26.4,53.11 26.4,54.7 26.27,54.83 24.54,54.83 19.93,59.45 4.99,59.45 4.59,59.04 4.59,58.56 U2.28
BTN3
  Top 0.152: R3.1 43.3,51.56 42.99,51.88 | 42.99,51.88 S3.2 | U2.1 3.25,57.72 2.54,58.42 2.54,59.05 3.17,59.69 4.8,59.69 4.87,59.75 20.89,59.75 22.23,58.42 34.29,58.42 37.88,54.83 38.97,54.83 39.1,54.7 39.1,53.11 38.97,52.98 38.12,52.98 S3.1 S3.2 | S3.2 42.99,51.88
BTN4
  Top 0.152: R4.1 56,51.56 S4.2 S4.1 50.22,52.38 51.7,52.38 52.44,53.11 52.44,54.7 52.3,54.83 50.58,54.83 46.35,59.05 22.02,59.05 21.02,60.06 3.11,60.06 2.23,59.18 2.23,58.29 3.14,57.39 3.67,57.39 U2.2
BTN5
  Top 0.152: 68.58,52.07 S5.2 | 68.58,52.07 69.98,52.07 R5.1 | U2.5 3.67,56.19 3.22,56.19 1.93,57.48 1.93,59.31 2.99,60.36 21.14,60.36 22.15,59.36 46.48,59.36 48.69,57.15 60.33,57.15 62.64,54.83 64.37,54.83 64.5,54.7 64.5,53.11 64.37,52.98 63.52,52.98 S5.1 68.58,52.07
BTN6
  Top 0.152: U2.6 3.67,55.64 3.22,55.64 2.54,54.96 2.54,51.44 11.14,42.84 13.8,42.84 13.93,42.7 13.93,41.12 13.8,40.98 12.79,40.98 S6.1 S6.2 19.18,40.01 R6.1
BTN7  (2 unrouted)
  Top 0.152: S7.1 25.42,40.91 26.27,40.91 26.4,41.05 26.4,42.63 26.27,42.77 24.88,42.77 24.83,42.72 21.31,42.72 20.73,43.29 20.73,44.44 20.6,44.57 19.41,44.57 19.29,44.45 9.96,44.45 3.17,51.23 3.17,54.75 U2.7
BTN8  (2 unrouted)
  Top 0.152: S8.1 38.12,40.91 38.97,40.91 39.1,41.05 39.1,42.63 38.97,42.77 36.82,42.77 35.39,41.34 33.43,43.29 33.43,44.44 32.99,44.88 19.28,44.88 19.16,44.76 10.08,44.76 3.92,50.91 3.92,52.18 4.45,52.7 4.45,54.47 U2.8
BTN9
  Top 0.152: R9.1 57.28,40.01 S9.2 S9.1 50.22,40.31 51.7,40.31 52.44,41.05 52.44,42.63 52.3,42.77 50.91,42.77 50.86,42.72 44.81,42.72 44.35,43.18 36.2,43.18 35.33,44.04 35.33,44.44 34.59,45.18 19.16,45.18 19.06,45.09 12.06,45.09 12.06,45.41 10.03,45.41 5.71,49.73 5.71,52.7 6.35,53.34 6.35,53.93 6.44,54.02 6.44,54.47 U2.13
BTN10
  Top 0.152: R10.1 69.98,40.01 S10.2 S10.1 62.92,40.31 64.4,40.31 65.14,41.05 65.14,42.63 65,42.77 63.62,42.77 63.56,42.72 59.41,42.72 58.83,43.29 58.83,44.44 58.7,44.57 57.51,44.57 57.39,44.45 56.52,44.45 55.88,45.09 | 55.88,45.09 55.78,45.18 | 55.88,45.09 55.24,45.72 10.16,45.72 6.35,49.53 6.35,52.07 6.99,52.7 6.92,52.77 U2.14
BTN11  (via drill 0.35)
  Top 0.152: R11.1 19.18,28.57 S11.2 S11.1 10.65,27.42 10.65,27.18 10.52,27.04 8.53,27.04 8.4,27.18 8.4,28.43 3.17,33.66 v3.17,48.9 | v8.89,53.34 8.89,54.61 8.19,55.31 U2.15
  Bottom 0.152: v3.17,48.9 7.62,53.34 v8.89,53.34
BTN12  (via drill 0.35)
  Top 0.152: R12.1 30.6,28.07 S12.2 S12.1 24.82,28.88 26.3,28.88 27.04,29.61 27.04,31.2 26.91,31.34 25.52,31.34 25.29,31.11 17.43,31.11 17.2,31.34 12.81,31.34 12.59,31.11 6.35,31.11 3.81,33.66 v3.81,46.99 | v10.16,53.98 8.42,55.72 U2.16
  Bottom 0.152: v10.16,53.98 9.5,53.31 9.5,53.09 3.81,47.4 v3.81,46.99
BTN13  (via drill 0.35)  (1 unrouted)
  Top 0.152: R13.1 43.3,28.07 S13.2 | S13.1 38.06,28.57 39.1,29.61 39.1,31.2 38.97,31.34 37.58,31.34 37.19,30.94 30.3,30.94 29.6,31.64 24.24,31.64 23.5,32.38 23.26,32.38 22.5,33.14 19.41,33.14 19.29,33.02 5.08,33.02 4.45,33.66 v4.45,45.72 | v11.43,53.98 8.49,56.91 U2.19
  Bottom 0.152: v4.45,45.72 4.45,46.99 v11.43,53.98
BTN14  (via drill 0.35)
  Top 0.152: R14.1 56,28.07 S14.2 S14.1 50.82,29.48 51.67,29.48 51.8,29.61 51.8,31.2 51.67,31.34 50.28,31.34 50.23,31.29 44.81,31.29 44.35,31.75 41.27,31.75 39.37,33.66 6.35,33.66 5.71,34.29 v5.71,46.35 | v12.06,55.24 9.99,57.31 U2.20
  Bottom 0.152: v5.71,46.35 12.06,52.7 v12.06,55.24
BTN15  (via drill 0.35)
  Top 0.152: R15.1 69.98,28.57 S15.2 S15.1 63.59,29.55 64.6,29.55 64.73,29.68 64.73,31.27 64.6,31.41 63.21,31.41 63.09,31.29 57.51,31.29 57.05,31.75 53.34,31.75 51.13,33.96 6.68,33.96 6.35,34.29 v6.35,45.09 | v9.47,58.37 8.89,57.78 7.76,57.78 U2.21
  Bottom 0.152: v6.35,45.09 6.35,46.35 13.34,53.34 13.34,56.52 11.43,58.42 9.53,58.42 v9.47,58.37
BTN16  (1 unrouted)
  Top 0.152: S16.2 17.27,11.43 R16.1
BTN17  (1 unrouted)
  Top 0.152: R17.1 31.25,11.43 S17.2
BTN18
  Top 0.152: S18.2 45.22,11.43 R38.1
BTN19
  Top 0.152: S19.2 71.88,10.93 R39.1
BTN20
  Top 0.152: S20.2 59.19,11.43 R40.1
ENCODER1  (2 unrouted)
GND  (99 unrouted)
LED1  (via drill 0.35)
  Top 0.152: Q1.1 23,54.61 v23.5,54.61 | v29.21,60.33 41.05,60.33 41.66,60.93 42.52,60.93 42.55,60.96 43.18,60.33 73.66,60.33 79.38,54.61 79.38,46.99 80.01,46.35 81.92,46.35 82.55,45.72 82.39,45.55 U3.27
  Bottom 0.152: v23.5,54.61 v29.21,60.33
LED2  (via drill 0.35)
  Top 0.152: Q2.1 35.7,54.61 v36.2,54.61 | v41.91,60.33 42.55,59.69 55.24,59.69 55.88,59.05 73.66,59.05 78.74,53.98 78.74,46.35 79.38,45.72 81.28,45.72 81.98,45.02 U3.28
  Bottom 0.152: v36.2,54.61 v41.91,60.33
LED3  (via drill 0.35)
  Top 0.152: Q3.1 48.41,54.61 v48.9,54.61 | v53.98,58.42 73.03,58.42 78.11,53.34 78.11,45.09 79.44,43.74 U3.1
  Bottom 0.152: v48.9,54.61 49.53,54.61 53.34,58.42 v53.98,58.42
LED4  (via drill 0.35)
  Top 0.152: Q4.1 61.59,54.12 v61.59,53.98 | v65.41,57.15 67.94,57.15 68.58,57.78 72.39,57.78 77.47,52.7 77.47,45.09 79.21,43.34 U3.2
  Bottom 0.152: v61.59,53.98 64.77,57.15 v65.41,57.15
LED5
  Top 0.152: Q5.1 76.83,50.95 76.83,48.9 | 76.83,48.9 76.83,48.26 | 76.83,48.9 76.83,44.45 79.14,42.15 U3.5
LED6  (via drill 0.35)
  Top 0.152: Q6.1 25.23,43.65 v25.4,43.81 | v28.57,46.35 38.73,46.35 39.37,46.99 60.33,46.99 60.96,46.35 73.66,46.35 76.2,43.81 76.2,38.73 76.36,38.57 U3.6
  Bottom 0.152: v25.4,43.81 26.04,43.81 v28.57,46.35
LED7  (via drill 0.35)
  Top 0.152: Q7.1 35.56,42.69 v35.56,42.55 | v40.01,46.35 59.69,46.35 60.33,45.72 73.66,45.72 75.56,43.81 75.56,38.73 76.2,38.1 77.33,38.1 U3.7
  Bottom 0.152: v35.56,42.55 39.37,46.35 v40.01,46.35
LED8  (via drill 0.35)
  Top 0.152: Q8.1 53.8,43.65 53.98,43.81 v54.61,43.81 | v57.15,45.72 59.05,45.72 59.69,45.09 73.66,45.09 74.93,43.81 74.93,36.2 75.56,35.56 77.47,35.56 78.11,36.2 78.11,36.83 78.17,36.9 U3.8
  Bottom 0.152: v54.61,43.81 55.24,43.81 v57.15,45.72
LED9
  Top 0.152: Q9.1 69.28,43.65 70.21,44.57 73.3,44.57 74.3,43.58 74.3,35.56 74.93,34.92 79.38,34.92 80.17,35.73 U3.13
LED10
  Top 0.152: Q10.1 73.66,42.69 73.66,35.56 74.93,34.29 79.38,34.29 80.64,35.56 80.64,37.33 U3.14
LED11  (1 unrouted)
LED12  (via drill 0.35)
  Top 0.152: Q12.1 38.56,32.22 v38.73,32.38 | v45.09,34.92 72.39,34.92 74.93,32.38 v83.19,32.38 | v86.36,33.02 86.36,41.27 85.89,41.74 U3.16
  Bottom 0.152: v38.73,32.38 42.55,32.38 v45.09,34.92 | v83.19,32.38 85.72,32.38 v86.36,33.02
LED13  (via drill 0.35)  (1 unrouted)
  Top 0.152: Q13.1 50.63,32.22 v50.8,32.38 | v55.24,33.02 57.39,33.02 57.81,33.45 73.43,33.45 73.74,33.14 73.74,32.94 74.93,31.75 76.83,31.75 77.47,31.11 83.19,31.11 84.45,32.38 84.45,35.56 83.96,36.05
  Bottom 0.152: v50.8,32.38 54.61,32.38 v55.24,33.02
LED14  (1 unrouted)
  Top 0.152: Q14.1 69.28,32.22 70.21,33.14 73.3,33.14 73.43,33.01 73.43,32.61 74.93,31.11 76.83,31.11 77.17,30.79 83.49,30.79 84.78,32.08 84.78,35.87 84.29,36.36
LED15  (2 unrouted)
  Top 0.152: Q15.1 74.44,30.48 83.82,30.48 85.09,31.75 85.09,36.2 84.45,36.83
M1  (1 unrouted)
M2  (1 unrouted)
M3  (1 unrouted)
M4  (1 unrouted)
M5  (1 unrouted)
M6  (1 unrouted)
M7  (1 unrouted)
M8  (1 unrouted)
M9  (1 unrouted)
M10  (1 unrouted)
M11  (1 unrouted)
M12  (1 unrouted)
M13
  Top 0.152: Q20.1 68.11,23.8 82.04,23.8 82.98,22.86 83.19,22.86 83.19,22.66 83.49,22.35 83.49,20.62 82.31,19.45 U4.19
M14  (1 unrouted)
M15
  Top 0.152: Q30.1 72.24,23.5 81.92,23.5 83.19,22.23 83.19,20.95 82.48,20.25 U4.21
N$1  (3 unrouted)
N$2  (1 unrouted)
N$3  (1 unrouted)
N$4  (via drill 0.35)
  Top 0.152: LCD1.4 65.02,65.16 v60.96,69.22 | v58.42,69.22 56.52,71.12 56.52,72.98 56.61,73.07 56.61,73.52 U1.27
  Bottom 0.152: v60.96,69.22 v58.42,69.22
N$5
  Top 0.152: LCD1.5 62.48,66.42 57.08,71.83 U1.28
N$6  (1 unrouted)
N$7  (via drill 0.35)
  Top 0.152: LCD1.7 55.24,66.03 v55.24,69.85 | U1.13 55.15,77.61 55.15,78.06 55.28,78.19 55.47,78.19 v55.88,78.61
  Bottom 0.152: v55.24,69.85 55.24,77.97 v55.88,78.61
N$8  (via drill 0.35)  (1 unrouted)
  Top 0.152: LCD1.8 54.86,65.79 v54.61,66.04
N$9  (1 unrouted)
N$10  (1 unrouted)
N$11  (1 unrouted)
N$12  (1 unrouted)
N$13  (1 unrouted)
N$14
  Top 0.152: LCD1.14 47.5,71.75 53.34,71.75 54.68,73.09 U1.22
N$17  (2 unrouted)
N$18  (1 unrouted)
N$19  (1 unrouted)
N$20  (2 unrouted)
N$24  (2 unrouted)
N$37
  Top 0.152: D1.C 20.49,53.98 Q1.3
N$38
  Top 0.152: D1.A 11.81,52.68 10.95,52.68 9.84,51.56 R18.1
N$39
  Top 0.152: D2.C 33.26,53.91 Q2.3
N$40
  Top 0.152: D2.A 24.35,52.68 23.65,52.68 22.54,51.56 R19.1
N$41
  Top 0.152: D3.C 45.96,53.91 Q3.3
N$42
  Top 0.152: D3.A 37.05,52.68 36.35,52.68 35.24,51.56 R20.1
N$43
  Top 0.152: D4.C 58.66,53.91 Q4.3
N$44
  Top 0.152: D4.A 50.38,52.68 49.05,52.68 47.94,51.56 R21.1
N$45
  Top 0.152: D5.C 70.25,53.91 Q5.3
N$46
  Top 0.152: D5.A 62.45,52.68 61.75,52.68 60.64,51.56 R22.1
N$47
  Top 0.152: D6.C 20.49,41.91 Q6.3
N$48
  Top 0.152: R23.1 11.94,41.91 D6.A
N$49
  Top 0.152: D7.C 33.26,41.84 Q7.3
N$50
  Top 0.152: R24.1 24.57,41.84 D7.A
N$51
  Top 0.152: D8.C 45.96,41.84 Q8.3
N$52
  Top 0.152: D8.A 37.05,40.62 36.35,40.62 35.24,39.5 R25.1
N$53
  Top 0.152: D9.C 58.66,41.84 Q9.3
N$54
  Top 0.152: D9.A 50.38,40.62 49.05,40.62 47.94,39.5 R26.1
N$55
  Top 0.152: D10.C 71.36,41.84 Q10.3
N$56
  Top 0.152: D10.A 63.09,40.62 61.75,40.62 60.64,39.5 R27.1
N$57
  Top 0.152: D11.C 20.56,30.41 Q11.3
N$58
  Top 0.152: D11.A 12.29,29.18 10.95,29.18 9.84,28.07 R28.1
N$59
  Top 0.152: D12.C 33.26,30.41 Q12.3
N$60
  Top 0.152: D12.A 24.98,29.18 23.65,29.18 22.54,28.07 R29.1
N$61
  Top 0.152: D13.C 45.96,30.41 Q13.3
N$62
  Top 0.152: D13.A 37.05,29.18 36.35,29.18 35.24,28.07 R30.1
N$63
  Top 0.152: D14.C 58.66,30.41 Q14.3
N$64
  Top 0.152: D14.A 49.75,29.18 49.05,29.18 47.94,28.07 R31.1
N$65
  Top 0.152: D15.C 71.29,30.48 Q15.3
N$66
  Top 0.152: D15.A 62.61,29.18 61.75,29.18 60.64,28.07 R32.1
N$67  (1 unrouted)
  Top 0.152: R33.1 7.93,10.93 10.57,13.56 11.97,13.56 12.1,13.7 12.1,14.01 13.34,15.24 D16.AR
N$68  (1 unrouted)
  Top 0.152: D17.AB 28.45,16.64 R34.1
N$69  (1 unrouted)
  Top 0.152: D18.AB 43.05,17.27 R35.1
N$70  (1 unrouted)
  Top 0.152: R36.1 51.85,13.24 53.56,13.24 55.56,15.24 D19.AR
N$71
  Top 0.152: R37.1 63.81,10.93 66.45,13.56 67.85,13.56 67.98,13.7 67.98,14.01 69.22,15.24 D20.AR D20.AB
N$72
  Top 0.152: D16.CR 10.7,15.76 10.48,15.76 10.35,15.89 10.35,16.79 Q16.3
N$73
  Top 0.152: Q21.3 11.05,13.97 D16.CG
N$74
  Top 0.152: D16.CB 12.7,17.82 Q26.3
N$78
  Top 0.152: D17.CR 24.67,15.76 24.45,15.76 23.32,16.89 Q17.3
N$79
  Top 0.152: Q22.3 23.5,14.14 D17.CG
N$80
  Top 0.152: D17.CB 26.67,17.82 Q27.3
N$84
  Top 0.152: D18.CR 38.64,15.76 38.42,15.76 38.29,15.89 38.29,16.79 Q18.3
N$85
  Top 0.152: Q23.3 38.99,13.97 D18.CG
N$86
  Top 0.152: D18.CB 40.64,17.82 Q28.3
N$90
  Top 0.152: D19.CR 52.61,15.76 52.39,15.76 52.26,15.89 52.26,16.79 Q19.3
N$91
  Top 0.152: Q24.3 52.97,13.97 D19.CG
N$92
  Top 0.152: D19.CB 54.61,17.82 Q29.3
N$96
  Top 0.152: D20.CR 66.58,15.76 66.36,15.76 66.23,15.89 66.23,16.79 Q20.3
N$97
  Top 0.152: Q25.3 66.94,13.97 D20.CG
N$98
  Top 0.152: D20.CB 68.58,17.82 Q30.3
ROTA  (2 unrouted)
ROTB  (2 unrouted)
SCL_A  (5 unrouted)
SDA_A  (5 unrouted)
U1RESET  (2 unrouted)
U2RESET  (2 unrouted)
U3RESET  (2 unrouted)
U4RESET  (2 unrouted)
VDD  (1 unrouted)
VSS  (1 unrouted)